# Altium schematic sheet Power_Board.SchDoc: =SheetTitle
size A4; SheetTitle: Power Management Board; DrawnBy: Samyar Sadat Akhavi; SheetNumber: 1; SheetTotal: 18
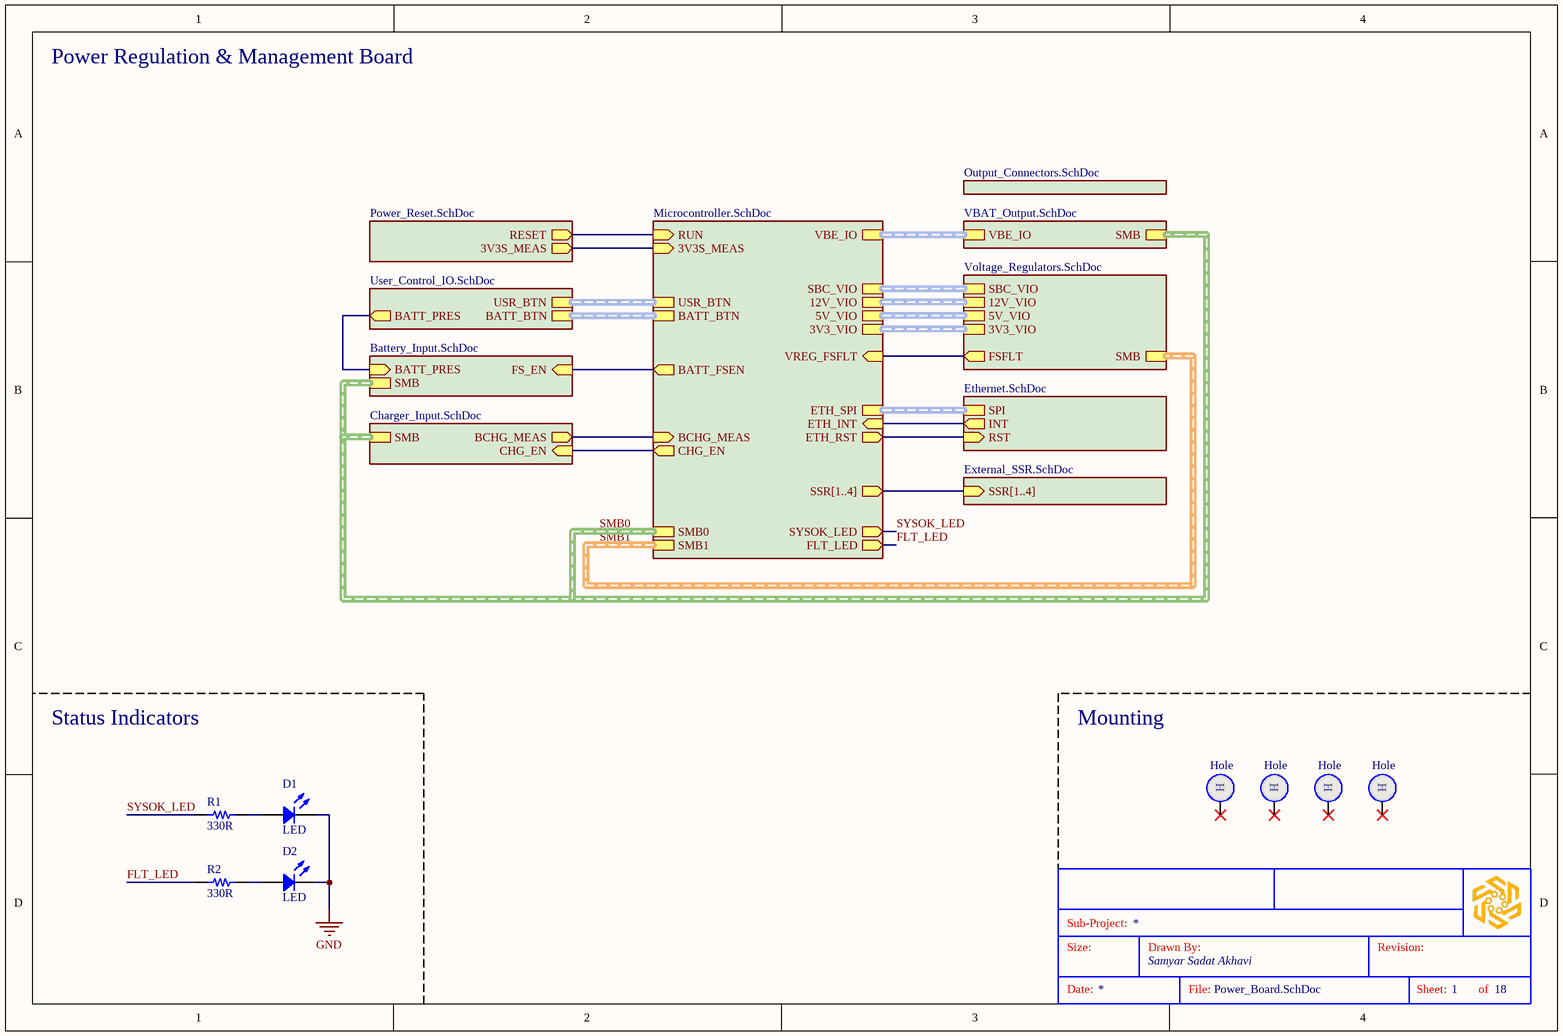
[diagram p0: Power_Board.SchDoc]

## Parts
?  (no value)  (graphical)
D1  LED  [LED 0805_2012]
D2  LED  [LED 0805_2012]
MHL1  Hole  [Hole_3.5mm]  (no BOM)
MHL2  Hole  [Hole_3.5mm]  (no BOM)
MHL3  Hole  [Hole_3.5mm]  (no BOM)
MHL4  Hole  [Hole_3.5mm]  (no BOM)
R1  330R  [RES 0603_1608]
R2  330R  [RES 0603_1608]

## Sub-sheets
BATT = Battery_Input.SchDoc: FS_EN (in), BATT_PRES (in), SMB (harness SMBus)
CHG_IN = Charger_Input.SchDoc: CHG_EN (in), BCHG_MEAS (out), SMB (harness SMBus)
ETHERNET = Ethernet.SchDoc: SPI (harness SPI_FD), INT (out), RST (in)
EXT_SSR = External_SSR.SchDoc: SSR[1..4] (in)
MCU = Microcontroller.SchDoc: RUN (in), 3V3S_MEAS (in), BATT_FSEN (out), USR_BTN (harness USR_BTN), BATT_BTN (harness USR_BTN), VBE_IO (harness VBP_IO), BCHG_MEAS (in), CHG_EN (out), SBC_VIO (harness VHP_VIO), 12V_VIO (harness VHP_VIO), 5V_VIO (harness V3I_VIO), 3V3_VIO (harness V3I_VIO), VREG_FSFLT (in), ETH_SPI (harness SPI_FD), ETH_INT (in), ETH_RST (out), SMB1 (harness SMBus), SMB0 (harness SMBus), FLT_LED (out), SYSOK_LED (out), SSR[1..4] (out)
OUT_CONNS = Output_Connectors.SchDoc: no entries
PWR = Power_Reset.SchDoc: RESET (out), 3V3S_MEAS (out)
USR_CTRL = User_Control_IO.SchDoc: BATT_PRES (out), BATT_BTN (harness USR_BTN), USR_BTN (harness USR_BTN)
VBAT_OUTS = VBAT_Output.SchDoc: VBE_IO (harness VBP_IO), SMB (harness SMBus)
VOLT_REGS = Voltage_Regulators.SchDoc: SBC_VIO (harness VHP_VIO), 12V_VIO (harness VHP_VIO), 3V3_VIO (harness V3I_VIO), 5V_VIO (harness V3I_VIO), FSFLT (out), SMB (harness SMBus)

## Nets
GND: D1.2(K) D2.2(K)
FLT_LED: R2.1 ; sheet MCU/FLT_LED
SYSOK_LED: R1.1 ; sheet MCU/SYSOK_LED
NetD1_1: D1.1(A) R1.2
NetD2_1: D2.1(A) R2.2
(unnamed): sheet VOLT_REGS/FSFLT, sheet MCU/VREG_FSFLT
(unnamed): sheet PWR/RESET, sheet MCU/RUN
(unnamed): sheet PWR/3V3S_MEAS, sheet MCU/3V3S_MEAS
(unnamed): sheet MCU/BATT_FSEN, sheet BATT/FS_EN
(unnamed): sheet MCU/BCHG_MEAS, sheet CHG_IN/BCHG_MEAS
(unnamed): sheet MCU/CHG_EN, sheet CHG_IN/CHG_EN
(unnamed): sheet MCU/ETH_INT, sheet ETHERNET/INT
(unnamed): sheet MCU/ETH_RST, sheet ETHERNET/RST
(unnamed): sheet BATT/BATT_PRES, sheet USR_CTRL/BATT_PRES

Not connected (* = marked no-connect by the designer): MHL1 1*; MHL2 1*; MHL3 1*; MHL4 1*

## Buses and harness runs
bus sheet EXT_SSR/SSR[1..4] = sheet MCU/SSR[1..4]
harness sheet ETHERNET/SPI = sheet MCU/ETH_SPI
harness sheet MCU/3V3_VIO = sheet VOLT_REGS/3V3_VIO
harness sheet MCU/5V_VIO = sheet VOLT_REGS/5V_VIO
harness sheet MCU/12V_VIO = sheet VOLT_REGS/12V_VIO
harness sheet MCU/BATT_BTN = sheet USR_CTRL/BATT_BTN
harness sheet MCU/SBC_VIO = sheet VOLT_REGS/SBC_VIO
harness sheet MCU/USR_BTN = sheet USR_CTRL/USR_BTN
harness sheet MCU/VBE_IO = sheet VBAT_OUTS/VBE_IO
harness SMB0 = sheet BATT/SMB = sheet CHG_IN/SMB = sheet MCU/SMB0 = sheet VBAT_OUTS/SMB
harness SMB1 = sheet MCU/SMB1 = sheet VOLT_REGS/SMB

## Notes on the sheet
- Power Regulation & Management Board
- Status Indicators
- Mounting
- Sub-Project:
- Size:
- Drawn By:
- Revision:
- Date:
- File:
- Sheet:
- of
- (in symbol GEN-PCBMHL3S5) H

## Library data of the parts
? = SGR-STDTBSA4: STANDARD SCHEMATICS TITLE BLOCK
D1 = GEN-CILGRNLCLR805: GENERIC 0805 INDICATOR LED; Color: Green; Lens Color: Clear; Part Number: GEN-CILGRNLCLR805
D2 = GEN-CILAMBLCLR805: GENERIC 0805 INDICATOR LED; Color: Amber; Lens Color: Clear; Part Number: GEN-CILAMBLCLR805
MHL1-MHL4 = GEN-PCBMHL3S5: CIRCULAR PCB MOUNTING HOLE; Part Number: GEN-PCBMHL3S5; Size Variant: 3.5mm
R1 R2 = GEN-CRR330T5P8603: GENERIC 0603 CHIP RESISTOR; Tolerance: ±5%; Power: 0.125W; Part Number: GEN-CRR330T5P8603; Value: 330R